# Altium schematic sheet mpc57_clk.SchDoc: Clock/Reset Drivers
size Letter; Organization: NewAE Technology Inc.; Address1: 1083 Queen St., Suite 196; Address2: Halifax; Address3: NS; Address4: Canada B3H 0B2; SheetApproved: YES
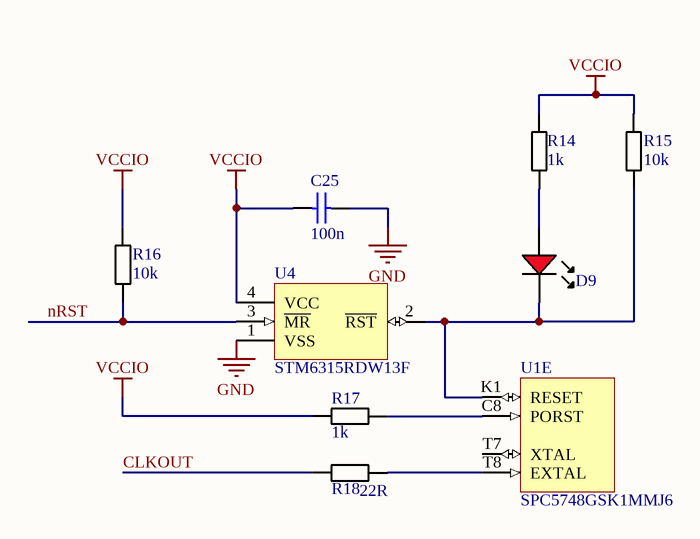
[diagram p0: mpc57_clk.SchDoc]

## Parts
C25  100n  [CAPC0402_M]
D9  LED, 0603, Red  [LED-0603-RED]  (value not drawn)
R14  1k  [RESC1608X55N]
R15  10k  [RESC1608X55N]
R16  10k  [RESC1608X55N]
R17  1k  [RESC1608X55N]
R18  22R  [RESC1608X55N]
U1  SPC5748GSK1MMJ6  [BGA256C100P16X16_1700X1700X170]  (part E of 5)
U4  STM6315RDW13F  [SOT143B]

## Nets
GND: C25.2 U4.1(VSS)
VCCIO: C25.1 R14.1 R15.1 R16.1 R17.1 U4.4(VCC)
CLKOUT: R18.1
nRST: R16.2 U4.3(~{MR})
NetD9_A: D9.A R14.2
NetD9_K: D9.K R15.2 U1.K1(RESET) U4.2(~{RST})
NetR17_2: R17.2 U1.C8(PORST)
NetR18_2: R18.2 U1.T8(EXTAL)

Not connected (* = marked no-connect by the designer): U1 T7(XTAL)

## Notes on the sheet
- Title:
- Date:
- Rev:
- Time:
- Project:
- Sheet
- of
- License:
- Copyright © NewAE Technology Inc.
- Approved:
- NewAE.com
- File:

## Library data of the parts
C25 = CCHIP-100n-0402: 100n, 0402; Case-EIA: 0402; Part Number: CCHIP-100n-0402; Component Kind: Standard; Component Type: Standard; Footprint: 0402; Pin Count: 2; Value: 100n; Mounting Technology: SMT
D9 = LEDCHIP_0603_RED: Chip LED, Red; Part Number: LEDCHIP_0603_RED; Component Kind: Standard; Component Type: Standard; Pin Count: 2; Mounting Technology: SMT
R14 R17 = RCHIP-1K-0603: 1k res, 0603, 1%, 1/10W; Manufacture 1: Yageo; Manufacture Part Number 1: RC0603FR-071KL; Case-EIA: 0603; Case-Metric: 1608; Rated Power: 0.1W; Rated Voltage: 75VDC; Part Number: RCHIP-1K-0603; Component Kind: Standard; Component Type: Standard; Footprint: 0603; Pin Count: 2; Supplier 1: Digi-Key; Supplier Part Number 1: 311-1.00KHRCT-ND; Value: 1k; Tolerance: 1%; Mounting Technology: SMT; Temperature Range: -55C to 155C
R15 R16 = RCHIP-10K-0603: 10k res, 0603, 1%, 1/10W; Manufacture 1: Yageo; Manufacture Part Number 1: RC0603FR-0710KL; Case-EIA: 0603; Case-Metric: 1608; Rated Power: 0.1W; Rated Voltage: 75VDC; Part Number: RCHIP-10K-0603; Component Kind: Standard; Component Type: Standard; Footprint: 0603; Pin Count: 2; Supplier 1: Digi-Key; Supplier Part Number 1: 311-10.0KHRCT-ND; Value: 10k; Tolerance: 1%; Mounting Technology: SMT; Temperature Range: -55C to 155C
R18 = RCHIP-22R-0603: 22R res, 0603, 1%, 1/10W; Manufacture 1: Yageo; Manufacture Part Number 1: RC0603FR-0722RL; Case-EIA: 0603; Case-Metric: 1608; Rated Power: 0.1W; Rated Voltage: 75VDC; Part Number: RCHIP-22R-0603; Component Kind: Standard; Component Type: Standard; Footprint: 0603; Pin Count: 2; Supplier 1: Digi-Key; Supplier Part Number 1: 311-22.0HRCT-ND; Value: 22R; Tolerance: 1%; Mounting Technology: SMT; Temperature Range: -55C to 155C
U1 = SPC5748GSK1MMJ6: Freescale 32-bit MCU, Triple core, 6MB Flash, 160MHz, -40/+125degC, Automotive Qualified, BGA 256
U4 = STM6315RDW13F: 2.93V Reset Controller, 112mS; Manufacture 1: ST Microelectronics; Pitch: 1.92mm; Part Number: STM6315RDW13F; Component Kind: Standard; Component Type: Standard; Footprint: SOT-143-4; Manufacture Part Number 1: STM6315RDW13F; Pin Count: 4; Supplier 1: Digi-Key; Supplier Part Number 1: 497-5127-1-ND; Mounting Technology: SMT; RoHS: Yes; Temperature Range: -40C to 125C